# Altium schematic sheet led controller and photodiode.SchDoc
size A4
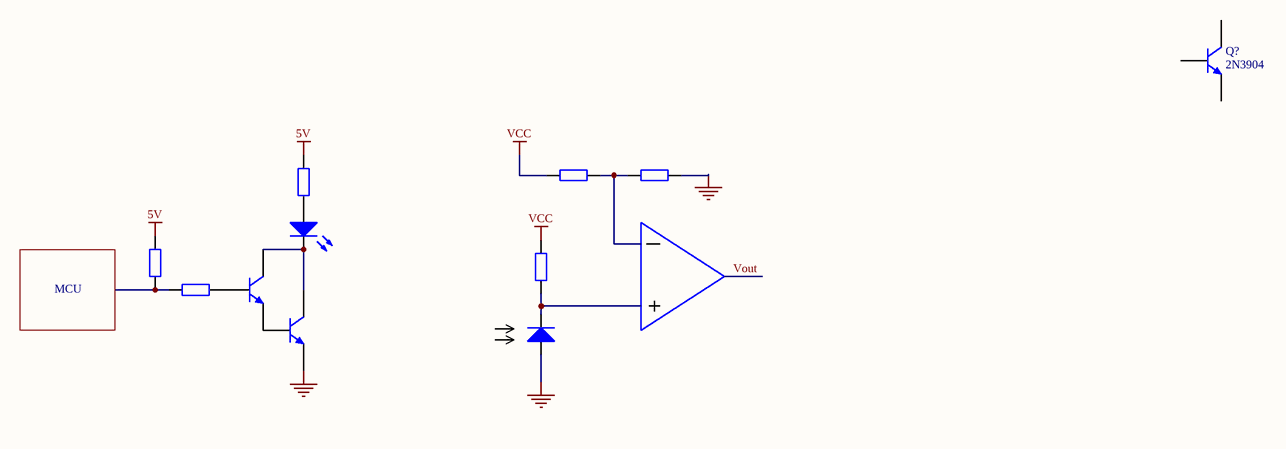
[diagram p0: led controller and photodiode.SchDoc]

## Parts
(Parts that share a designator on the sheet are numbered #1, #2 ... from top to bottom, then left to right.)
D?#1  LED0  [LED-0]  (value not drawn)
D?#2  Diode BAS116  [SOT-23]  (value not drawn)
Q?#1  2N3904  [TO-92A]
Q?#2  2N3904  [TO-92A]  (value not drawn)
Q?#3  2N3904  [TO-92A]  (value not drawn)
R?#1  Res2  [AXIAL-0.4]  (value not drawn)
R?#2  Res2  [AXIAL-0.4]  (value not drawn)
R?#3  Res2  [AXIAL-0.4]  (value not drawn)
R?#4  Res2  [AXIAL-0.4]  (value not drawn)
R?#5  Res2  [AXIAL-0.4]  (value not drawn)
R?#6  Res2  [AXIAL-0.4]  (value not drawn)

## Sub-sheets
Designator = MCU: no entries

## Nets
5V: R?#3.2 R?#5.2
NetD?#2_1: D?#2.1(A) Q?#3.1(E) R?#2.1
VCC: R?#1.2 R?#4.1
NetD?#1_1: D?#1.1(A) R?#3.1
NetD?#1_2: D?#1.2(K) Q?#2.3(C) Q?#3.3(C)
NetD?#2_3: D?#2.3(K) R?#4.2
NetQ?#2_1: Q?#2.1(E) Q?#3.2(B)
NetQ?#2_2: Q?#2.2(B) R?#6.2
NetR?#1_1: R?#1.1 R?#2.2
NetR?#5_1: R?#5.1 R?#6.1

Not connected (* = marked no-connect by the designer): Q?#1 1(E) 2(B) 3(C)

## Library data of the parts
D?#1 = LED0: Typical INFRARED GaAs LED; Published: 8-Jun-2000; LatestRevisionDate: 08-Jul-2005; LatestRevisionNote: Mech Layer 1 removed.; PackageReference: LED-0; Publisher: Altium Limited
D?#2 = Diode BAS116: Silicon Low Leakage Diode; Note: Pin 2 is not connected and not drawn.; Published: 21-Mar-2003; DatasheetDocument: Oct-1999; PackageDocument: Sep-2001; PackageReference: SOT-23; Publisher: Altium Limited; ComponentLink1Description: Manufacturer Link; ComponentLink1URL: http://www.infineon.com/; ComponentLink2Description: Datasheet; ComponentLink2URL: http://www.infineon.com/upload/Document/cmc_upload/documents/080/656/bas116series.pdf
Q?#1-Q?#3 = 2N3904: NPN General Purpose Amplifier; Published: 8-Jun-2000; LatestRevisionDate: 15-Jan-2003; LatestRevisionNote: PCB Footprint 'BCY-W3/D4.7' replaced; DatasheetDocument: 1997; PackageDocument: Sep-1998; PackageReference: TO-92A; Publisher: Altium Limited; Code_JEDEC: TO-92A; ComponentLink1Description: Manufacturer Link; ComponentLink1URL: http://www.fairchildsemi.com/; ComponentLink2Description: Datasheet; ComponentLink2URL: http://www.fairchildsemi.com/ds/2N%2F2N3904.pdf
R?#1-R?#6 = Res2: Resistor; Value: 1K; Published: 8-Jun-2000; LatestRevisionDate: 17-Jul-2002; LatestRevisionNote: Re-released for DXP Platform.; PackageReference: AXIAL-0.4; Publisher: Altium Limited